# EAGLE design formica_nice (EAGLE 5.06)
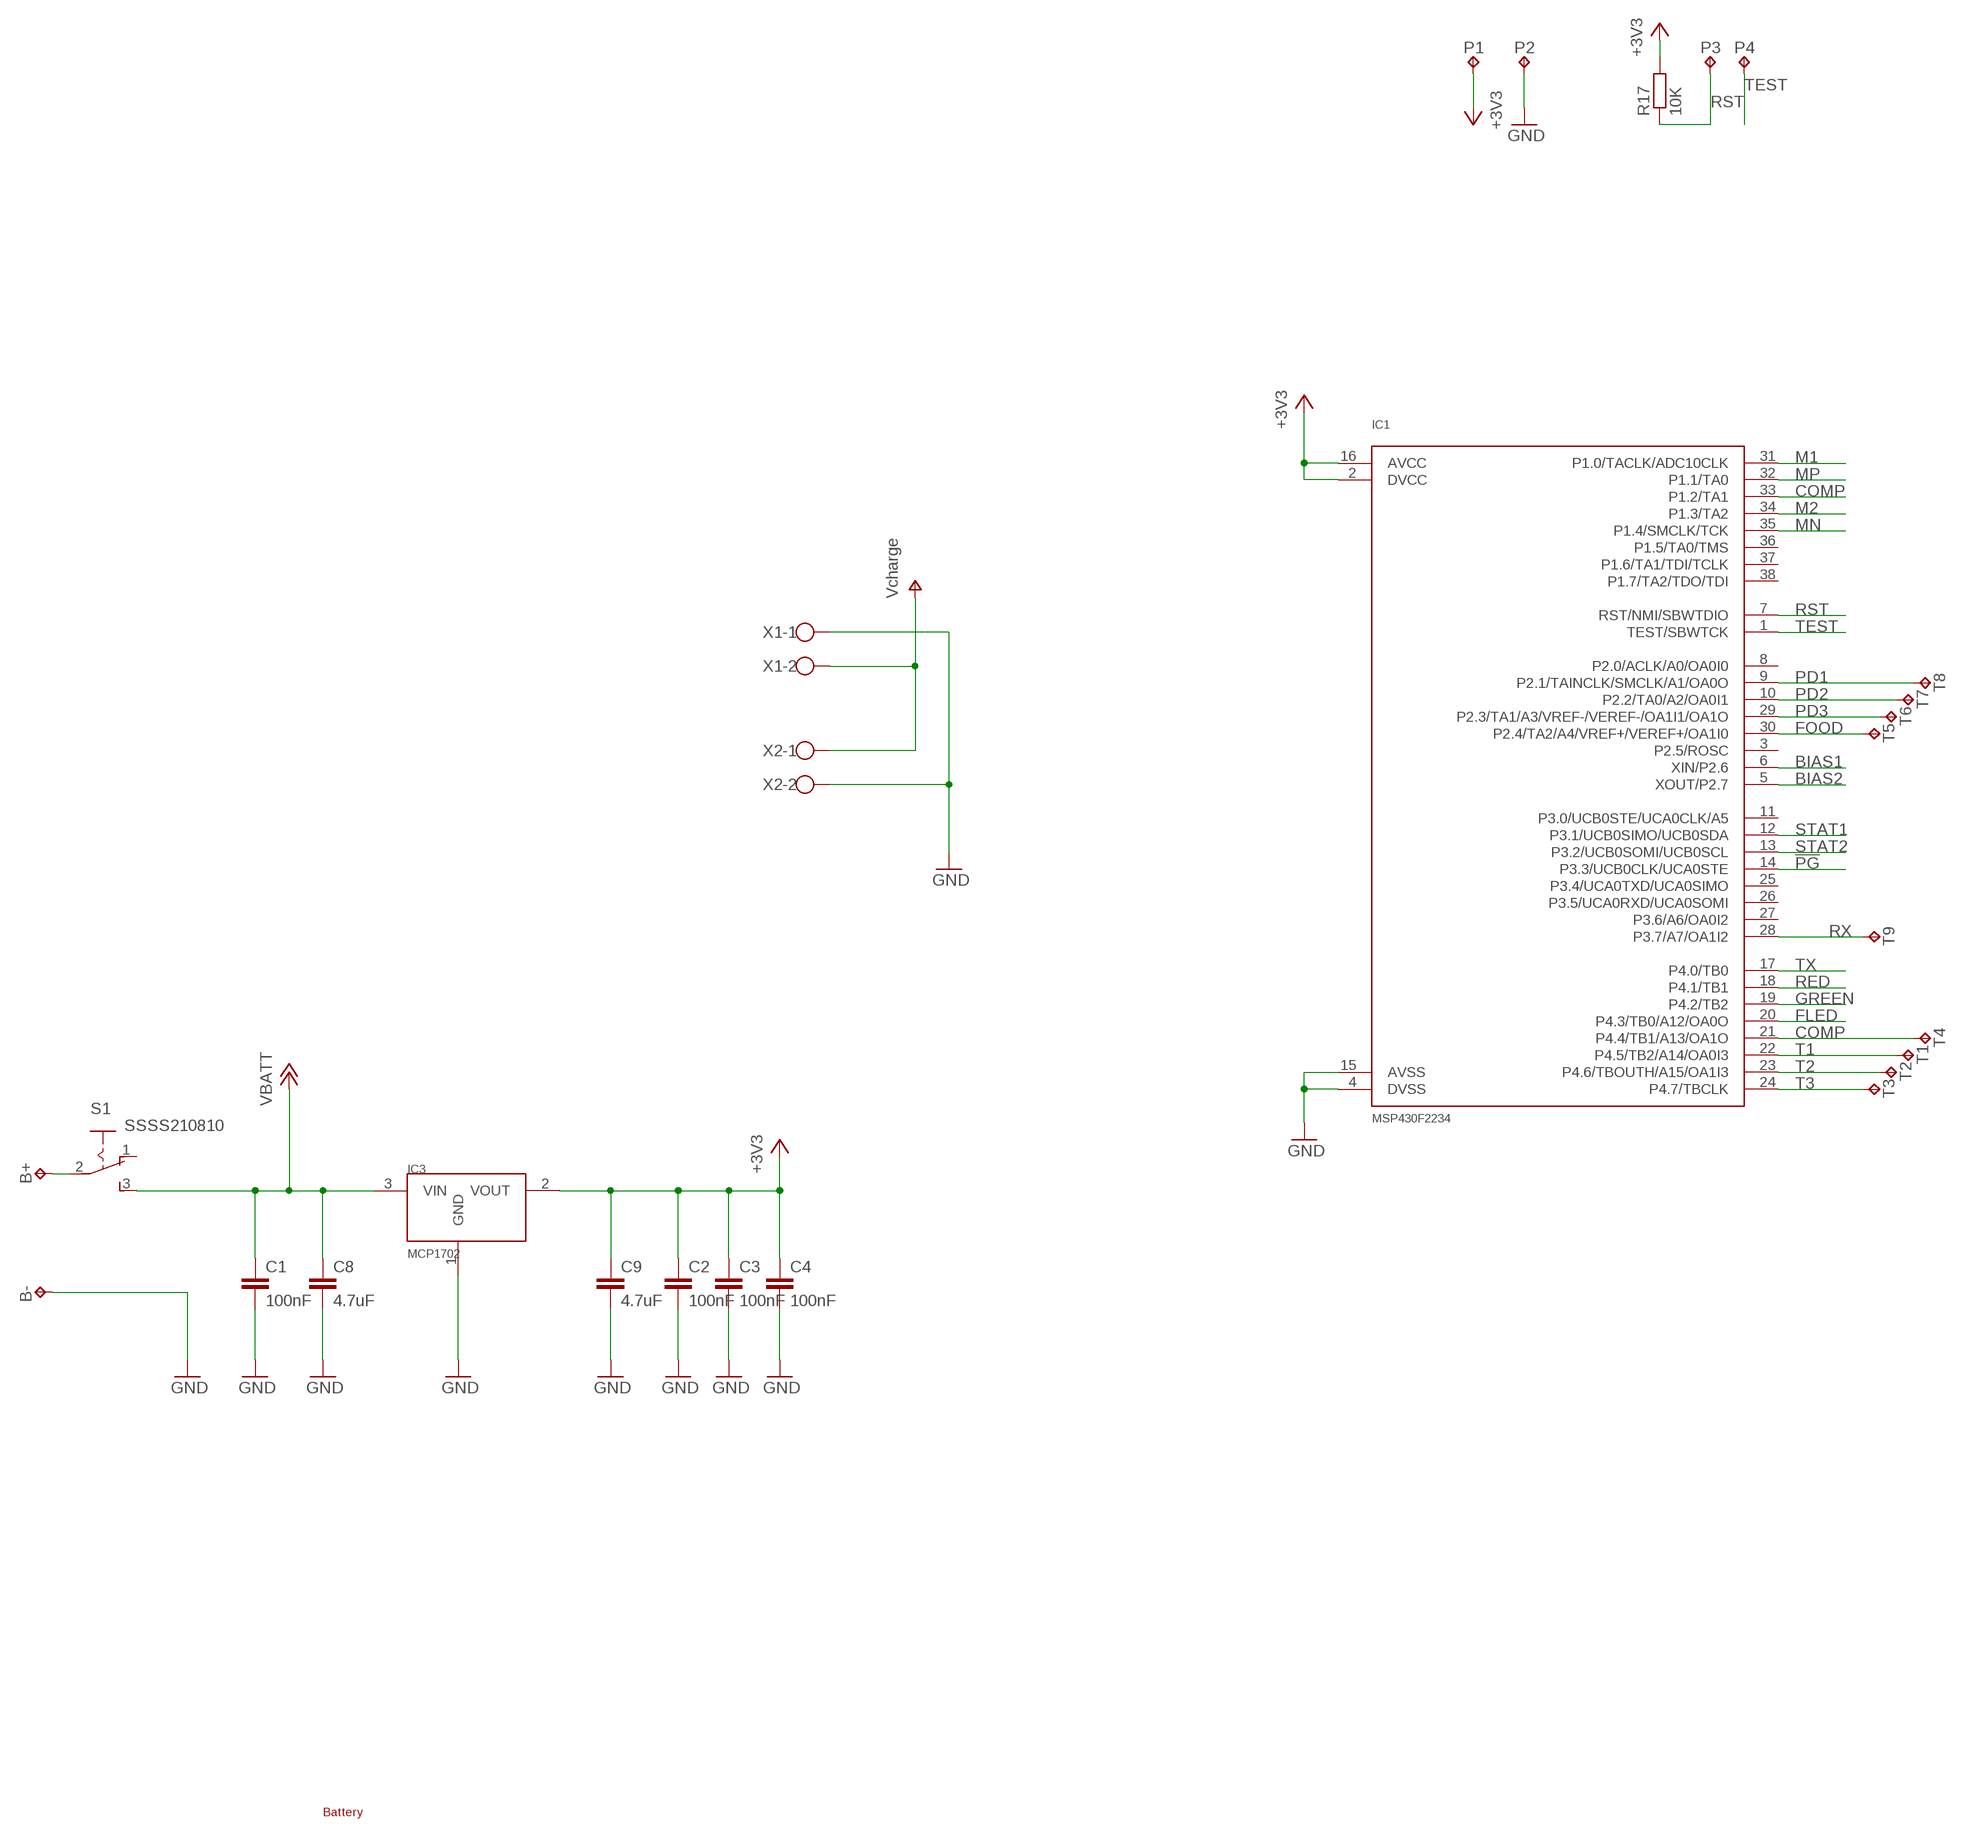
[diagram p0: schematic, sheet 1, part 1 of 2]
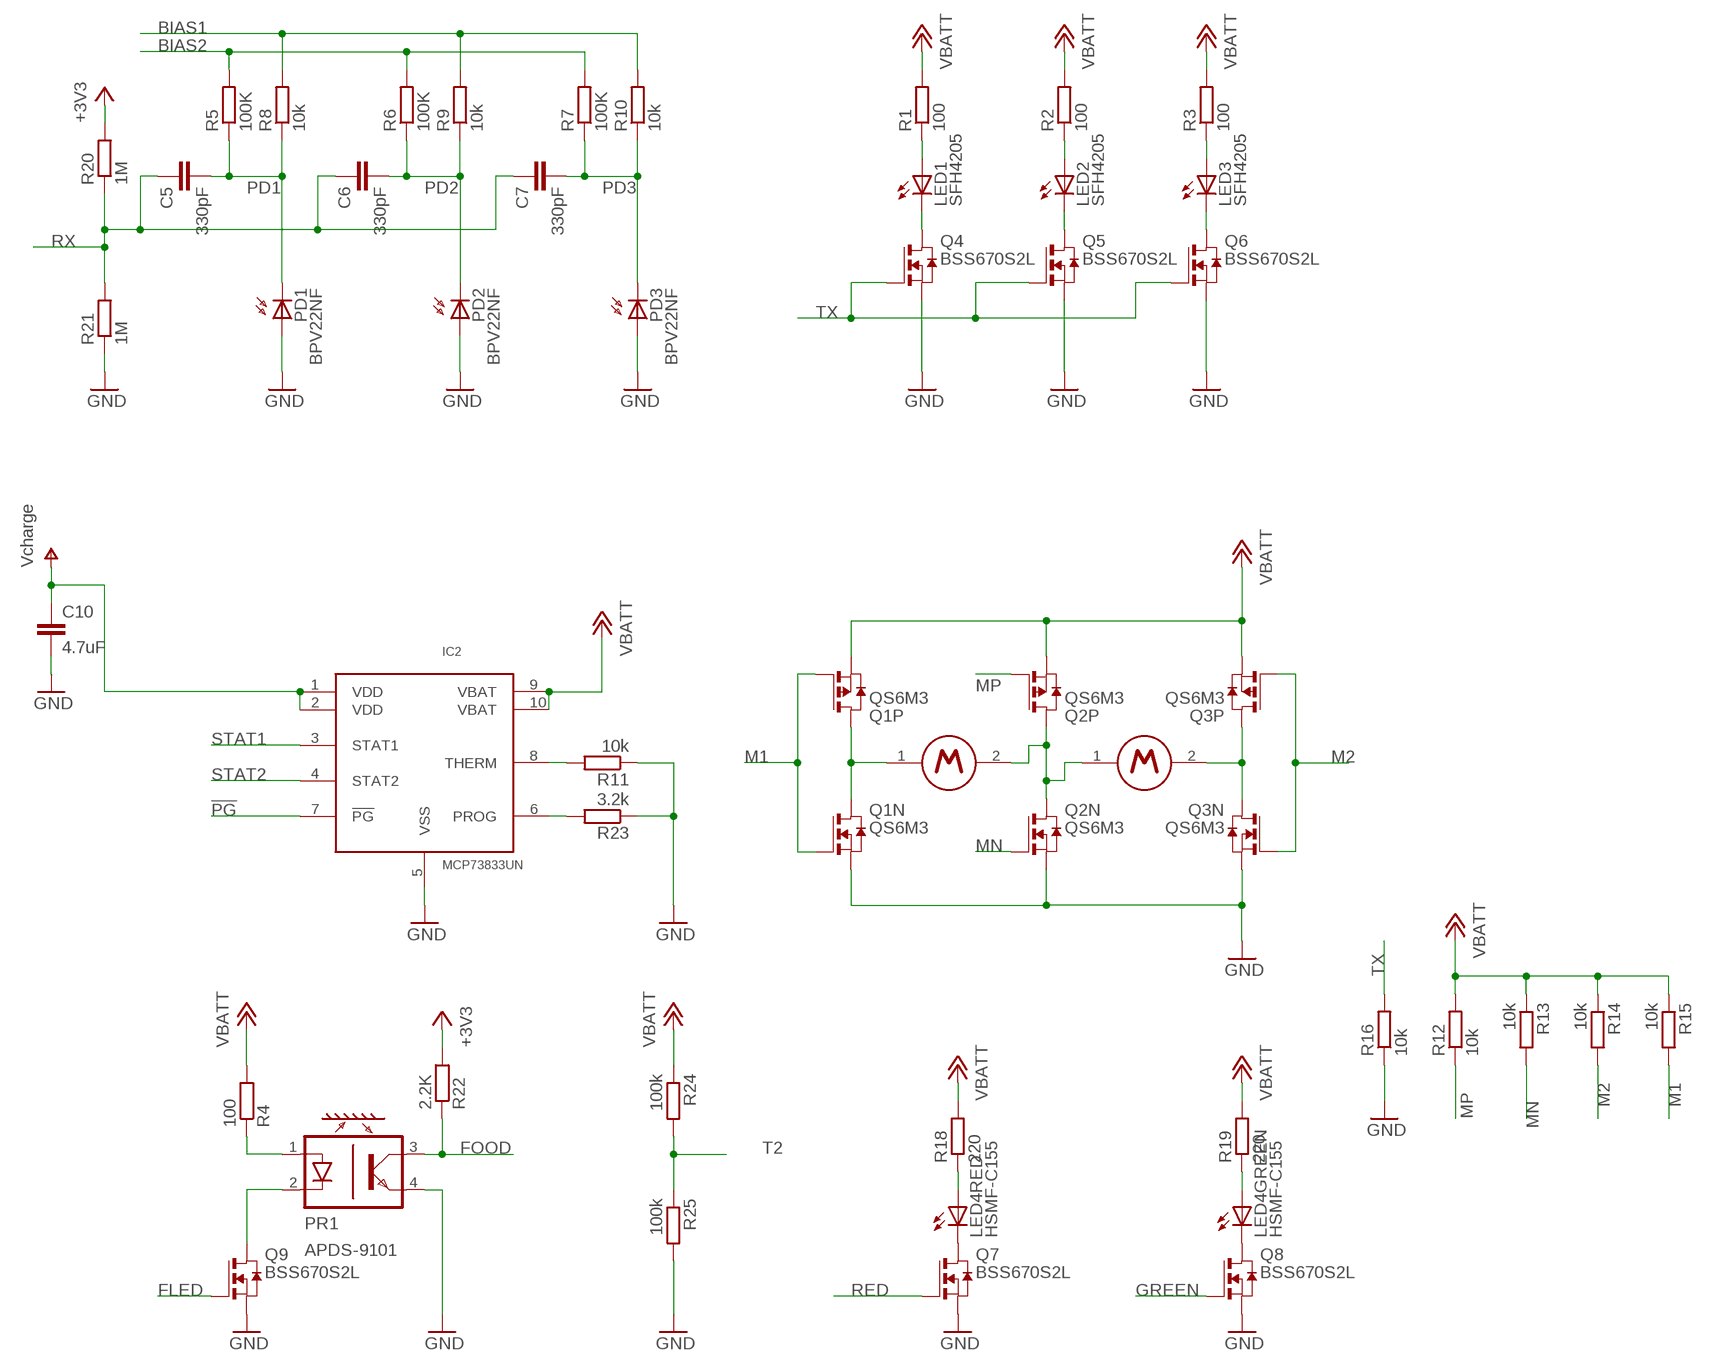
[diagram p1: schematic, sheet 1, part 2 of 2]

## Parts
B+  TPPAD1-13  [P1-13]
B-  TPPAD1-13  [P1-13]
C1  100nF  C-EUC0603  [C0603]
C2  100nF  C-EUC0603  [C0603]
C3  100nF  C-EUC0603  [C0603]
C4  100nF  C-EUC0603  [C0603]
C5  330pF  C-EUC0603  [C0603]
C6  330pF  C-EUC0603  [C0603]
C7  330pF  C-EUC0603  [C0603]
C8  4.7uF  C-EUC0805  [C0805]
C9  4.7uF  C-EUC0805  [C0805]
C10  4.7uF  C-EUC0805  [C0805]
IC1  MSP430F2234  [TSSOP38]
IC2  MCP73833UN  [MSOP10]
IC3  MCP1702  [SOT23-3L]
LED1  SFH4205  [SFH4205]
LED2  SFH4205  [SFH4205]
LED3  SFH4205  [SFH4205]
LED4  HSMF-C155  [BILED]
M1  MOTOR  [MOTOR]
M2  MOTOR  [MOTOR]
P1  TPB1,27  [B1,27]
P2  TPB1,27  [B1,27]
P3  TPB1,27  [B1,27]
P4  TPB1,27  [B1,27]
PD1  BPV22NF  [BPV22NF]
PD2  BPV22NF  [BPV22NF]
PD3  BPV22NF  [BPV22NF]
PR1  APDS-9101  [APDS-9101]
Q1  QS6M3  [SOT23-6]
Q2  QS6M3  [SOT23-6]
Q3  QS6M3  [SOT23-6]
Q4  BSS670S2L  [SOT23-3L]
Q5  BSS670S2L  [SOT23-3L]
Q6  BSS670S2L  [SOT23-3L]
Q7  BSS670S2L  [SOT23-3L]
Q8  BSS670S2L  [SOT23-3L]
Q9  BSS670S2L  [SOT23-3L]
R1  100  R-EU_R0603  [R0603]
R2  100  R-EU_R0603  [R0603]
R3  100  R-EU_R0603  [R0603]
R4  100  R-EU_R0603  [R0603]
R5  100K  R-EU_R0603  [R0603]
R6  100K  R-EU_R0603  [R0603]
R7  100K  R-EU_R0603  [R0603]
R8  10k  R-EU_R0603  [R0603]
R9  10k  R-EU_R0603  [R0603]
R10  10k  R-EU_R0603  [R0603]
R11  10k  R-EU_R0603  [R0603]
R12  10k  R-EU_R0603  [R0603]
R13  10k  R-EU_R0603  [R0603]
R14  10k  R-EU_R0603  [R0603]
R15  10k  R-EU_R0603  [R0603]
R16  10k  R-EU_R0603  [R0603]
R17  10K  R-EU_R0603  [R0603]
R18  220  R-EU_R0603  [R0603]
R19  220  R-EU_R0603  [R0603]
R20  1M  R-EU_R0603  [R0603]
R21  1M  R-EU_R0603  [R0603]
R22  2.2K  R-EU_R0603  [R0603]
R23  3.2k  R-EU_R0603  [R0603]
R24  100k  R-EU_R0603  [R0603]
R25  100k  R-EU_R0603  [R0603]
S1  SSSS210810  [SSSS210810]
T1  TPB1,27  [B1,27]
T2  TPB1,27  [B1,27]
T3  TPB1,27  [B1,27]
T4  TPB1,27  [B1,27]
T5  TPB1,27  [B1,27]
T6  TPB1,27  [B1,27]
T7  TPB1,27  [B1,27]
T8  TPB1,27  [B1,27]
T9  TPB1,27  [B1,27]
U$1  BATTERY  [BATTERY]
X1  W237-102  [W237-102]
X2  W237-102  [W237-102]

## Nets
!PG: IC1.14(P3.3/UCB0CLK/UCA0STE) IC2.7(!PG)
+3V3: C2.1 C3.1 C4.1 C9.1 IC1.2(DVCC) IC1.16(AVCC) IC3.2(VOUT) P1.PP(TP) R17.2 R20.2 R22.2
BATT+: B+.1(TP) S1.2(COM)
BIAS1: IC1.6(XIN/P2.6) R8.2 R9.2 R10.2
BIAS2: IC1.5(XOUT/P2.7) R5.2 R6.2 R7.2
COMP: IC1.21(P4.4/TB1/A13/OA1O) IC1.33(P1.2/TA1) T4.PP(TP)
FLED: IC1.20(P4.3/TB0/A12/OA0O) Q9.1(G)
FOOD: IC1.30(P2.4/TA2/A4/VREF+/VEREF+/OA1I0) PR1.3(COL) R22.1 T5.PP(TP)
GND: B-.1(TP) C1.2 C2.2 C3.2 C4.2 C8.2 C9.2 C10.2 IC1.4(DVSS) IC1.15(AVSS) IC2.5(VSS) IC3.1(GND) P2.PP(TP) PD1.A PD2.A PD3.A PR1.4(EMIT) Q1.5(N:S) Q2.5(N:S) Q3.5(N:S) Q4.2(S) Q5.2(S) Q6.2(S) Q7.2(S) Q8.2(S) Q9.2(S) R11.1 R16.1 R21.1 R23.1 R25.2 X1.1 X2.2
GREEN: IC1.19(P4.2/TB2) Q8.1(G)
M1: IC1.31(P1.0/TACLK/ADC10CLK) Q1.1(N:G) Q1.3(P:G) R15.2
M2: IC1.34(P1.3/TA2) Q3.1(N:G) Q3.3(P:G) R14.2
MN: IC1.35(P1.4/SMCLK/TCK) Q2.1(N:G) R13.2
MP: IC1.32(P1.1/TA0) Q2.3(P:G) R12.1
N$1: LED4.4(RED:K) Q7.3(D)
N$2: LED4.1(GREEN:A) R19.1
N$3: LED4.3(RED:A) R18.1
N$4: M2.2 Q3.4(P:D) Q3.6(N:D)
N$5: M1.2 M2.1 Q2.4(P:D) Q2.6(N:D)
N$6: M1.1 Q1.4(P:D) Q1.6(N:D)
N$7: IC2.8(THERM) R11.2
N$8: IC2.6(PROG) R23.2
N$9: PR1.2(C) Q9.3(D)
N$10: LED1.A R1.1
N$11: LED2.A R2.1
N$12: PR1.1(A) R4.1
N$13: LED3.A R3.1
N$14: LED1.K Q4.3(D)
N$15: LED2.K Q5.3(D)
N$16: LED3.K Q6.3(D)
N$17: LED4.2(GREEN:K) Q8.3(D)
PD1: C5.2 IC1.9(P2.1/TAINCLK/SMCLK/A1/OA0O) PD1.C R5.1 R8.1 T8.PP(TP)
PD2: C6.2 IC1.10(P2.2/TA0/A2/OA0I1) PD2.C R6.1 R9.1 T7.PP(TP)
PD3: C7.2 IC1.29(P2.3/TA1/A3/VREF-/VEREF-/OA1I1/OA1O) PD3.C R7.1 R10.1 T6.PP(TP)
RED: IC1.18(P4.1/TB1) Q7.1(G)
RST: IC1.7(RST/NMI/SBWTDIO) P3.PP(TP) R17.1
RX: C5.1 C6.1 C7.1 IC1.28(P3.7/A7/OA1I2) R20.1 R21.2 T9.PP(TP)
STAT1: IC1.12(P3.1/UCB0SIMO/UCB0SDA) IC2.3(STAT1)
STAT2: IC1.13(P3.2/UCB0SOMI/UCB0SCL) IC2.4(STAT2)
T1: IC1.22(P4.5/TB2/A14/OA0I3) T1.PP(TP)
T2: IC1.23(P4.6/TBOUTH/A15/OA1I3) R24.2 R25.1 T2.PP(TP)
T3: IC1.24(P4.7/TBCLK) T3.PP(TP)
TEST: IC1.1(TEST/SBWTCK) P4.PP(TP)
TX: IC1.17(P4.0/TB0) Q4.1(G) Q5.1(G) Q6.1(G) R16.2
VBATT: C1.1 C8.1 IC2.9(VBAT) IC2.10(VBAT) IC3.3(VIN) Q1.2(P:S) Q2.2(P:S) Q3.2(P:S) R1.2 R2.2 R3.2 R4.2 R12.2 R13.1 R14.1 R15.1 R18.2 R19.2 R24.1 S1.3(NO)
VCHARGE: C10.1 IC2.1(VDD) IC2.2(VDD) X1.2 X2.1 ; supply symbol labelled Vcharge
Unconnected: IC1.3(P2.5/ROSC) IC1.8(P2.0/ACLK/A0/OA0I0) IC1.11(P3.0/UCB0STE/UCA0CLK/A5) IC1.25(P3.4/UCA0TXD/UCA0SIMO) IC1.26(P3.5/UCA0RXD/UCA0SOMI) IC1.27(P3.6/A6/OA0I2) IC1.36(P1.5/TA0/TMS) IC1.37(P1.6/TA1/TDI/TCLK) IC1.38(P1.7/TA2/TDO/TDI) S1.1(NC)

## Library data of the parts
B+ B- P1-P4 T1-T9 = testpad:TP
C1-C10 = rcl:C-EU: CAPACITOR, European symbol
IC1 = formica:MSP430F2234
IC2 = formica:MCP73833
IC3 = formica:MCP1702
LED1-LED3 = formica:SFH4205
LED4 = formica:HSMF-C155
M1 M2 = formica:MOTOR
PD1-PD3 = formica:BPV22NF
PR1 = formica:APDS-9101
Q1-Q3 = formica:QS6M3
Q4-Q9 = formica:BSS670S2L
R1-R25 = rcl:R-EU_: RESISTOR, European symbol
S1 = formica:SSSS210810
U$1 = formica:BATTERY
X1 X2 = con-wago-500:W237-102: WAGO SCREW CLAMP

## Board
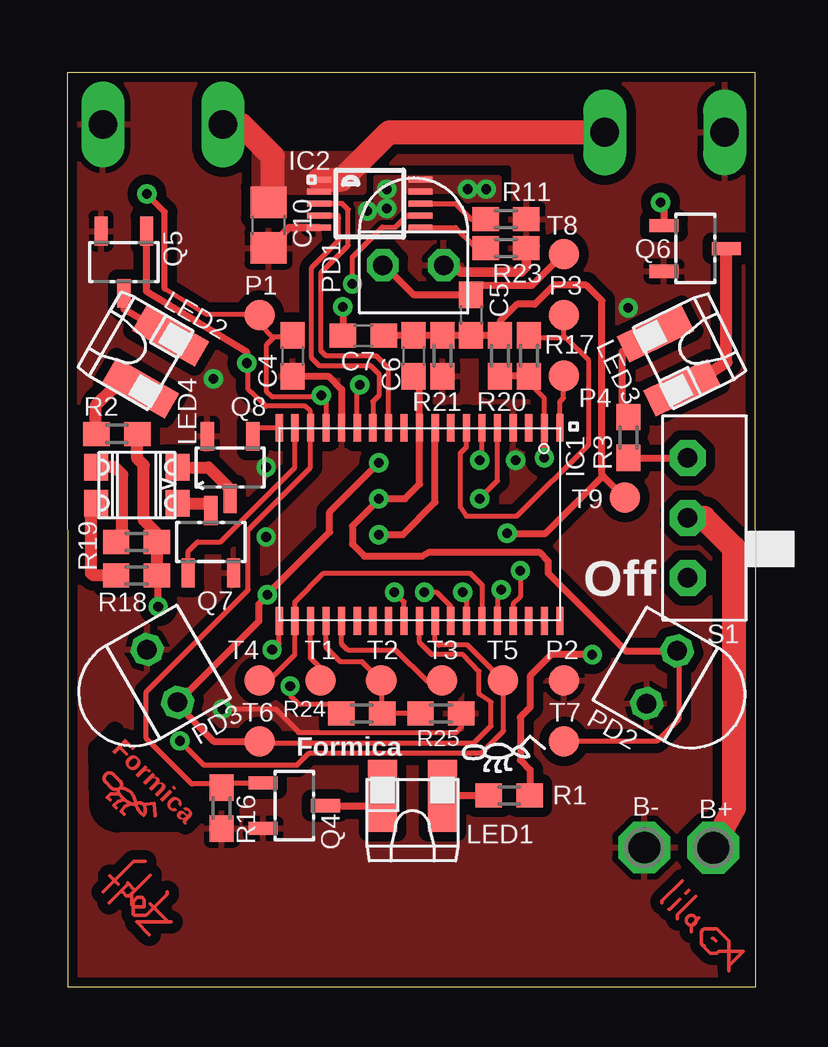
[diagram p2: board, top side]
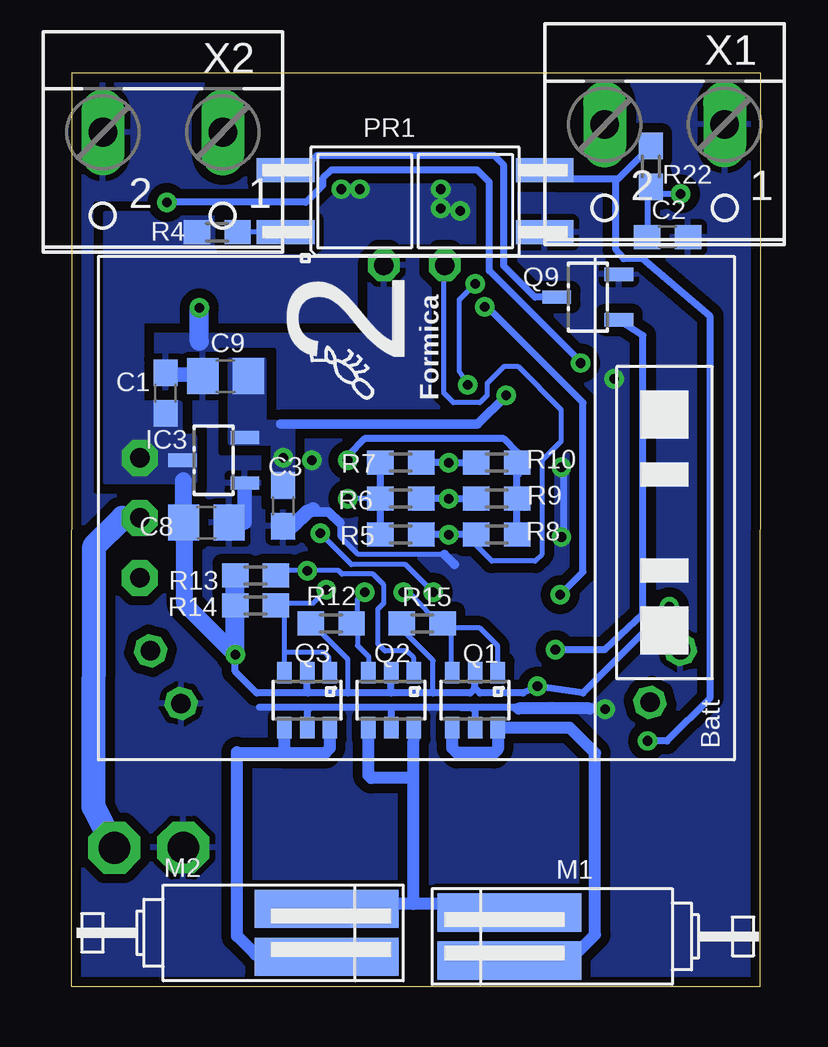
[diagram p3: board, bottom side, seen from below]

Size 28.73 x 38.1 mm. Coordinates in mm from the lower left corner, seen from the top.
Outline: 0.03,0 28.73,0 28.7,38.1 0,38.1 0.03,0
Copper layers (1*16): Top 0.035mm / dielectric 1.5mm / Bottom 0.035mm
Design rules "pcbtrain *": minimum track width 0.2mm, minimum drill 0.4mm, track to track 0.2mm, track to pad 0.2mm, pad to pad 0.2mm, via to via 0.2mm, smd to smd 0.15mm, copper to edge 0.25mm, drill to drill 8mil, minimum pad ring 10mil, minimum via ring 8mil, stop-mask expansion 0.125mm, vias tented up to drill 0mil, thermal gap 10mil
tRestrict: 4 lines
bRestrict: area 14.9,9.2 to 15.9,10.2

### Footprints (pad centres in the part's own frame; a part is rotated, then mirrored left to right if it is on the bottom)
P1-13 = drill 1.321 pad 2.159 octagon: 1 0,0
C0603 = smd 1.1 x 1: 1 -0.85,0; 2 0.85,0
C0805 = smd 1.3 x 1.5: 1 -0.95,0; 2 0.95,0
TSSOP38 = smd 1.15 x 0.3: 1 0,0; 2 0,-0.65; 3 0,-1.3; 4 0,-1.95; 5 0,-2.6; 6 0,-3.25; 7 0,-3.9; 8 0,-4.55; 9 0,-5.2; 10 0,-5.85; 11 0,-6.5; 12 0,-7.15; 13 0,-7.8; 14 0,-8.45; 15 0,-9.1; 16 0,-9.75; 17 0,-10.4; 18 0,-11.05; 19 0,-11.7; 20 8.05,-11.7; 21 8.05,-11.05; 22 8.05,-10.4; 23 8.05,-9.75; 24 8.05,-9.1; 25 8.05,-8.45; 26 8.05,-7.8; 27 8.05,-7.15; 28 8.05,-6.5; 29 8.05,-5.85; 30 8.05,-5.2; 31 8.05,-4.55; 32 8.05,-3.9; 33 8.05,-3.25; 34 8.05,-2.6; 35 8.05,-1.95; 36 8.05,-1.3; 37 8.05,-0.65; 38 8.05,0
MSOP10 = smd 0.25 x 1: 1 -1,-2.113; 2 -0.5,-2.113; 3 0,-2.113; 4 0.5,-2.113; 5 1,-2.113; 6 1,2.113; 7 0.5,2.113; 8 0,2.113; 9 -0.5,2.113; 10 -1,2.113
SOT23-3L = smd 0.55 x 1.2: 1 0.95,1.3; 2 -0.95,1.3; 3 0,-1.3
SFH4205 = smd 1.2 x 3: A -1.25,-0.8; K 1.25,-0.8
BILED = smd 1 x 1.1: 1 -0.1,2.1; 2 3.3,2.1; 3 -0.1,0.6; 4 3.3,0.6
MOTOR = smd 6 x 1.6: 1 6.8,3; 2 6.8,1
B1,27 = smd 1.27 x 1.27: PP 0,0
BPV22NF = drill 0.813 octagon: A 1.37,1.3; C 1.37,-1.24
APDS-9101 = smd 2.4 x 1: 1 -5.4,-1.3; 2 -5.4,1.3; 3 5.4,1.3; 4 5.4,-1.3
SOT23-6 = smd 0.6 x 0.9: 1 -0.95,-1.15; 2 0,-1.15; 3 0.95,-1.15; 4 0.95,1.15; 5 0,1.15; 6 -0.95,1.15
R0603 = smd 1.1 x 1: 1 -0.85,0; 2 0.85,0
SSSS210810 = drill 0.8 pad 1.5 octagon: 1 1.75,2.45; 2 4.25,2.45; 3 6.75,2.45
W237-102 = drill 1.194 long: 1 -2.5,-1.27; 2 2.5,-1.27

### Placement (x,y rotation side)
B+  26.94,5.79 0 top
B-  24.07,5.8 0 top
C1  24.8,24.75 90 bottom
C2  3.88,31.25 0 bottom
C3  19.9,20.05 270 bottom
C4  9.4,26.3 270 top
C5  16.85,28 90 top
C6  14.45,26.3 270 top
C7  12.35,27.15 180 top
C8  23.1,19.35 0 bottom
C9  22.3,25.45 180 bottom
C10  8.4,31.75 270 top
IC1  20.55,23.3 270 top
IC2  12.62,32.65 270 top
IC3  22.8,21.95 270 bottom
LED1  14.4,7.15 180 top
LED2  3,26.45 60 top
LED3  25.8,26.45 296 top
LED4  1.31,19.56 0 top
M1  3.67,4.1 180 bottom
M2  24.9,0.25 0 bottom
P1  8.02,28.01 0 top
P2  20.72,12.77 0 top
P3  20.72,28.01 0 top
P4  20.72,25.47 0 top
PD1  14.4,31.45 270 top
PD2  26,12.25 150 top
PD3  2.8,12.25 30 top
PR1  14.4,32.75 0 bottom
Q1  11.9,11.95 180 bottom
Q2  15.4,11.95 180 bottom
Q3  18.9,11.95 180 bottom
Q4  9.48,7.55 90 top
Q5  2.37,30.21 0 top
Q6  26.19,30.78 90 top
Q7  6,18.55 180 top
Q8  6.8,21.65 0 top
Q9  7.2,28.75 270 bottom
R1  18.44,7.97 0 top
R2  2.08,23.05 0 top
R3  23.4,22.9 270 top
R4  22.65,31.45 180 bottom
R5  15,18.85 180 bottom
R6  15,20.35 180 bottom
R7  15,21.85 180 bottom
R8  11,18.85 0 bottom
R9  11,20.35 0 bottom
R10  11,21.85 0 bottom
R11  18.3,32 180 top
R12  17.9,15.15 180 bottom
R13  21.05,17.15 0 bottom
R14  21.05,15.9 0 bottom
R15  14.1,15.15 0 bottom
R16  6.45,7.45 90 top
R17  19.25,26.3 270 top
R18  2.9,17.15 0 top
R19  2.9,18.55 0 top
R20  18.05,26.3 270 top
R21  15.65,26.3 90 top
R22  4.58,34.2 270 bottom
R23  18.3,30.8 180 top
R24  12.29,11.4 0 top
R25  15.59,11.4 0 top
S1  28.32,15.3 90 top
T1  10.56,12.77 0 top
T2  13.1,12.77 0 top
T3  15.64,12.77 0 top
T4  8.02,12.77 0 top
T5  18.18,12.77 0 top
T6  8.02,10.23 0 top
T7  20.72,10.23 0 top
T8  20.72,30.55 0 top
T9  23.26,20.39 0 top
U$1  27.6,30.45 270 bottom
X1  3.99,34.68 180 bottom
X2  24.91,34.36 180 bottom

### Tracks (layer width: path | path; a pad name or v marks a point on that pad's centre or on a via)
!PG  (via drill 0.4)
  Top 0.2: IC1.14 12.1,24.95 12.2,25.05 v12.2,25.1 | 14.83,32.15 IC2.7 14.18,32.15 13.7,31.68 13.15,31.68 11.9,30.43 v11.9,29.3
  Bottom 0.2: v11.9,29.3 12.55,28.65 12.55,25.65 v12.2,25.1
+3V3  (via drill 0.4)
  Top 0.2: 19.02,25.43 19,25.45 | 19.02,25.43 R17.2 | IC1.2 19.9,24.55 19.02,25.43 | C4.1 9.3,27.15 9.25,27.1 8.65,27.1 8.6,27.05 | 8.6,27.05 8.3,26.75 8.3,24.83 8.55,24.6 10.55,24.6 v10.6,24.65 10.8,24.45 IC1.16 | 8.6,27.05 8.02,27.63 P1.PP 8.02,28.03 8,28.05 5.8,28.05 4.08,29.1
  Top 0.25: 4.08,29.1 4.08,32.3 v3.32,33.05
  Top 0.3: v19.9,22.05 IC1.2 | R17.2 R20.2
  Bottom 0.25: 4.72,33.2 C2.1 | 4.72,33.2 R22.2 | 4.72,33.2 4.58,33.05 v3.32,33.05
  Bottom 0.3: v19.9,22.05 20.1,21.95 | C2.1 4.85,31.23
  Bottom 0.4: v10.6,24.65 11.8,23.45 20,23.45
  pour Bottom (isolate 0.01, no thermals): 19.5,23.55 19.5,20.4 20.3,20.4 20.3,22.65 22.1,22.65 22.1,26.15 20.7,26.15 20.7,23.55
ANT
  Top 0.15: 1.65,8.5 1.82,8.32 arc90 2.21,8.29 | 2.21,8.29 arc-90 2.85,7.65 2.86,7.63 2.92,7.65 arc-62 3.17,7.61 | 2.21,8.29 arc90 2.21,8.57 1.99,8.79 | 1.99,8.79 1.97,8.82 | 1.61,8.53 arc-180 1.93,8.85 1.99,8.79 | 2.05,7.46 1.95,7.56 2.12,7.74 2.35,7.79 2.39,7.8 2.59,7.67 2.68,7.63 | 2.39,7.19 2.27,7.31 2.41,7.52 2.68,7.63 | 2.84,7.58 arc-52 2.11,8.18 2.16,8.07 2.11,8.04 1.82,8.04 1.68,7.9 1.79,7.79 | 3.17,7.61 arc-76 3.2,7.15 arc-37 2.88,7.55 2.84,7.58 | 3.66,7.12 3.63,7.65 3.24,7.61 3.17,7.61 | 2.68,7.63 2.67,7.63 2.86,7.57 2.84,7.58
BATT+
  Top 1: 26.95,5.88 27.8,7.45 27.8,18.3 26.55,19.55 S1.2
  Bottom 1: B+.1 27.8,7.48 27.78,18.38 26.6,19.55 S1.2
BIAS1  (via drill 0.4)
  Top 0.2: IC1.6 17.3,22.05 v17.2,21.95
  Bottom 0.3: R8.2 10.2,18.85 10.15,18.9 R9.2 10.15,21.7 | 10.15,21.7 R10.2 | 10.15,21.7 10.1,21.35 | 10.15,21.7 10.15,22.3 10.71,22.85 16.5,22.85 17.2,22.15 v17.2,21.95
BIAS2  (via drill 0.4)
  Top 0.2: IC1.5 17.95,21.1 v17.2,20.35
  Top 0.3: v17.2,20.35
  Bottom 0.2: 15.9,20.35 v17.2,20.35
  Bottom 0.3: R7.2 15.85,20.4 15.9,20.35 R6.2 15.85,18.8 | R5.2 15.85,18.8 | 15.85,18.8 15.9,18.75
COMP
  Top 0.2: IC1.33 17.3,16.75 16.8,17.25 10.7,17.25 9.5,16.05 IC1.21 9.5,13.85 8.42,12.77 T4.PP 8.08,12.77 8.1,12.75
FLED  (via drill 0.4)
  Top 0.2: v8.55,14.05 8.6,14.05 8.85,14.3 IC1.20
  Bottom 0.3: Q9.1 4.9,27.15 4.9,15.55 6.5,14.05 v8.55,14.05
FOOD  (via drill 0.4)
  Top 0.2: 18.1,12.75 18.12,12.77 T5.PP | IC1.30 15.35,14.4 15.5,14.25 16.7,14.25 T5.PP | T5.PP 18.2,12.75 | v4.7,10.25 5.7,9.25 9.6,9.25 10.1,9.75 17.28,9.75 18.2,10.67 18.2,12.85 18.18,12.83 T5.PP
  Bottom 0.25: 8.43,33.68 5.95,33.68
  Bottom 0.3: 8.85,34 8.9,34.05 PR1.3 8.8,34.05 8.43,33.68 6.02,33.68 6.02,30.73 5.7,30.35 4.9,30.35 2.1,27.95 2.1,12.05 3.9,10.25 v4.7,10.25 | 5.95,33.68 R22.1
GND  (via drill 0.4)
  Top 0.2: 9.68,10.6 9.65,10.6 | 9.68,10.6 16.21,10.6 16.44,10.82 R25.2 | 9.68,10.6 8.7,11.57 v6.47,11.57
  Top 0.3: 9.45,25.7 9.7,25.45 10.9,25.45 11.45,24.9 IC1.15
  Top 0.305: IC2.5 9.25,31.65 C10.2
  Top 0.4: C4.2 9.45,25.7 | PD1.A 16.12,30.08 16.4,29.8 18.95,29.8 19.15,30 R23.1
  Bottom 0.2: 18.75,11.65 18.8,11.65 | 17.53,19.33 17.53,18.78 16.78,18.03 13.18,18.03 | 15.12,11.65 16.45,11.65 | v6.47,11.57 6.35,11.45 6.35,11.28
  Bottom 0.3: Q1.5 11.9,11.5 12.05,11.65 12.5,11.65 | 12.5,11.65 15.12,11.65 15.4,11.65 | 15.4,11.65 16.45,11.65 18.75,11.65 18.9,11.5 Q3.5 | 15.4,11.65 Q2.5 | 18.8,11.65 20.9,11.65 | 8.2,18.65 8.2,21.75 | 12.5,11.65 10.12,11.65 10.08,11.6 | C8.2 22.2,19.35 | 24.73,25.53 23.35,25.53
  Bottom 0.4: C8.2 22.15,19.4 | 12.75,17.6 13.18,18.03 | 19.5,19.2 C3.2 | 17.53,19.33 18,19.8 18.9,19.8 18.85,19.8
  Bottom 0.5: 7.12,11.6 10.08,11.6
  Bottom 0.6: IC3.1 21.5,19.35 22.2,19.35 | 18.65,19.9 18.9,19.8 19.5,19.2 | 23.35,25.53 24.88,25.53 | C1.2 24.73,25.53
  Bottom 0.8: 23.4,26.9 v23.4,28.3
  other vias: 8.3,21.65 8.3,18.75 18.7,21.95 6.1,25.35
  pour Bottom (isolate 0.4, rank 2): -0.45,38.3 -0.23,-0.3 28.87,-0.53 29.12,-0.27 28.85,38.3
  pour Top (isolate 0.4, rank 2): -0.6,35.85 -0.5,-0.75 29.05,-0.8 28.95,38.45 -0.55,38.45
GREEN
  Top 0.2: Q8.1 7.75,23.2 7.7,23.25 7.75,23.3 IC1.19
M1  (via drill 0.4)
  Top 0.2: IC1.31 16,15.85 15.4,16.45 v14.9,16.45
  Bottom 0.2: 12.9,13.25 12.9,14.9 13,15 R15.2 13.25,15 | Q1.1 10.95,14.2 11.7,14.95 13.25,14.95 13.25,15 | v14.9,16.45 14.65,16.45 13.25,15
  Bottom 0.3: v14.9,16.45 14.9,16.35 | Q1.3 12.85,13.2 12.9,13.25
M2  (via drill 0.4)
  Top 0.2: IC1.34 17.95,16.5 v18.1,16.55
  Bottom 0.2: 17.95,16.4 v18.1,16.55 18.65,16 20.05,16 R14.2 20,15.85 19.85,15.8 19.85,13.95 | Q3.1 18,13.15 18,13.75 18.2,13.95 19.85,13.95 | Q3.3 19.85,13.95
MN  (via drill 0.4)
  Top 0.2: v18.9,17.35 18.9,16.25 18.6,15.95 IC1.35
  Bottom 0.2: 14.4,13.05 Q2.1 14.45,13.7 14.75,14 15.65,14 15.95,14.3 15.95,15.75 15.7,16 15.7,16.75 16.15,17.2 17.45,17.2 17.6,17.35 v18.9,17.35 20,17.35 R13.2
MP  (via drill 0.4)
  Top 0.2: v16.5,16.45 16.5,16.55 | IC1.32 16.65,16.4 v16.5,16.45 | v16.5,16.45 16.6,16.55
  Bottom 0.2: R12.1 16.8,14.95 | Q2.3 16.35,13.78 16.8,14.22 16.8,14.95 | 16.8,14.95 16.8,16.15 v16.5,16.45
N$1
  Top 0.5: Q7.3 6,20.15 4.6,20.15 LED4.4
N$2
  Top 0.5: LED4.1 1.99,21.66 2.3,21.35 2.3,18.75 2.1,18.55 R19.1
N$3
  Top 0.5: R18.1 1.1,17.15 1,17.25 1,20.05 1.2,20.25 1.21,20.24 LED4.3
N$4
  Bottom 0.5: Q3.6 17.95,9.95 18.15,9.75 19.85,9.75 | 19.85,9.75 Q3.4 | 19.85,9.75 21.82,9.78 21.82,2.12 21.05,1.35 18.5,1.35 M2.2
N$5
  Bottom 0.5: M1.2 11.3,3.45 14.48,3.45 | 14.48,3.45 16.28,3.45 16.82,2.9 M2.1 | 14.48,3.45 14.48,8.7 | 14.48,8.7 14.48,9.72 Q2.6 | Q2.4 16.35,8.82 16.23,8.7 14.48,8.7
N$6
  Bottom 0.406: 7.97,1.1 M1.1
  Bottom 0.5: Q1.4 12.85,9.95 12.65,9.75 11.1,9.75 10.95,9.9 Q1.6 7.95,10.8 6.9,9.75 6.9,2.18 7.97,1.1 | M1.1 10.55,1.1
N$7
  Top 0.2: IC2.8 16.2,32.65 16.85,32 R11.2
N$8
  Top 0.2: IC2.6 16.2,31.65 17,30.85 17.53,30.85 | 17.53,30.85 17.4,31.05 | 17.53,30.85 R23.2
N$9
  Bottom 0.3: PR1.2 18.9,34.25 18.5,34.65 11.1,34.65 10.7,34.25 10.7,30.05 9.4,28.75 Q9.3 8.4,28.75
N$10
  Top 0.3: R1.1 17.6,7.96 17.6,7.95 LED1.A
N$11
  Top 0.5: LED2.A 1.92,24.97 1.2,24.25 1.2,23.05 R2.1
N$12
  Bottom 0.2: PR1.1 R4.1
N$13
  Top 0.3: LED3.A 23.15,26.5 23.15,24.1 23.4,23.85 R3.1
N$14
  Top 0.3: LED1.K 13.1,7.9 13.1,7.55 Q4.3
N$15
  Top 0.3: Q5.3 2.38,28.25 LED2.K
N$16
  Top 0.5: LED3.K 25.78,24.97 25.8,24.95 27.49,26.04 Q6.3
N$17
  Top 0.5: Q8.3 6.8,20.75 5.9,21.65 4.8,21.65 4.79,21.66 LED4.2
N$18
  Top 0.15: 25.65,4.42 24.8,3.58 24.8,3.5
N$19
  Top 0.15: 25.55,3.65 25.12,3.23 25.1,3.23
N$20
  Top 0.15: 25.8,3.9 25.93,4.02
N$21
  Top 0.15: 26.23,3.77 25.45,3 25.45,2.83
N$22
  Top 0.15: 26.35,2.88 26.03,2.55 26.03,2.3
N$23
  Top 0.15: 26.57,1.7 arc-90 26.45,1.83 26.45,2.25 arc-90 26.62,2.43 27.1,2.43 27.6,1.93 27.6,0.88 | 27.6,0.88 27.6,0.67 | 27.6,0.88 28.2,1.48 27.18,1.48 27.1,1.4 26.82,1.4 26.6,1.62
N$24
  Top 0.15: 26.9,2.02 26.95,2.02 27.05,1.93
N$25
  Top 0.15: 1.5,3.95 2.77,5.22 3.25,5.22
N$26
  Top 0.15: 2.12,4.27 1.78,4.62
N$27
  Top 0.15: 1.75,3.5 2.52,4.27 2.52,4.32 2.8,4.05 2.8,4 2.6,3.8 2.47,3.8 2.32,3.95 2.22,3.95
N$28
  Top 0.15: 3.47,4.65 2.7,3.88 2.7,3.43 2.8,3.33 3.22,3.33 3.22,3.62 3.12,3.73 2.92,3.73 2.75,3.55 2.75,3.02 2.8,2.98 3.25,2.98
N$29
  Top 0.15: 3.32,3 4.17,3.85 4.17,3.95
N$30
  Top 0.15: 4.22,2.7 3.47,3.45 | 4.22,2.7 4.35,2.7 | 4.22,2.7 2.9,2.7 3.42,2.18
PD1  (via drill 0.4)
  Top 0.3: IC1.9 15.35,20.2 14,18.85 v13,18.85 | PD1.C 13.18,30.08 13.2,30.1 14.45,28.85 C5.2 17.25,29.25 19.4,29.25 20.7,30.55 T8.PP
  Bottom 0.2: 13.2,29.75 13.2,24.75 12.8,24.35 11.7,24.35 11.4,24.65 11.4,25.15 10.7,25.85 10.1,25.85 8.3,24.05 8.3,22.75 9.1,21.95 9.1,18.05 9.4,17.75 11.2,17.75 11.85,18.4 R8.1
  Bottom 0.3: R5.1 14.2,18.85 | R5.1 v13,18.85 R8.1 11.8,18.85 | R5.1 14.15,18.9 | 13.15,29.75 13.16,29.76 PD1.C 13.17,29.78 13.2,29.75
PD2  (via drill 0.4)
  Top 0.2: T7.PP 24.58,10.23 25.5,11.15 25.5,14.05 25.46,14.01 PD2.C
  Top 0.3: 13.05,20.35 14.1,20.35 14.7,20.95 IC1.10 14.7,25.15 arc45 14.67,25.24 C6.2 | PD2.C 23.3,14 20.05,17.25 20.05,17.75 19.69,18.12 15.1,18.12 14.8,17.95 12.4,17.95 11.9,18.45 11.9,19.2 13.05,20.35 | 13.05,20.35 v13,20.35
  Bottom 0.3: 14.2,20.35 R6.1 v13,20.35 R9.1
PD3  (via drill 0.4)
  Top 0.2: IC1.29 14.7,14.35 15.2,13.85 16.5,13.85 17.18,13.15 17.18,12.2 17.68,11.88 17.68,10.88 16.98,10.17 8.55,10.17 8.55,10.23 T6.PP 8,10.25
  Top 0.3: v13,21.85 10.95,19.8 10.95,18.95 v8.35,16.35 8.4,16.35 8,15.95 8,15.25 PD3.C | v11.5,28.35 C7.2 | T6.PP 6.12,10.23 4.5,11.85 4.51,11.86 PD3.C | PD3.C 4.6,11.85
  Bottom 0.3: 14.15,21.8 14.2,21.75 | 14.15,21.8 R7.1 v13,21.85 R10.1 | 14.15,21.8 14.1,21.85 | v11.5,28.35 11.45,28.3 11.45,28.4 7.4,24.35 7.4,17.3 v8.35,16.35
RED
  Top 0.2: IC1.18 9.5,21.65 6.4,18.55 5.45,18.55 5.05,18.15 Q7.1
RST
  Top 0.2: IC1.7 16.65,22.5 16.4,22.25 16.4,20 16.65,19.62 18.75,19.62 21.75,22.6 21.75,26.1 20.8,27.05 20.7,27.05 | R17.1 19.03,27.08 19,27.05 20.7,27.05 | P3.PP 20.72,27.07 20.7,27.05
RX  (via drill 0.4)
  Top 0.2: IC1.28 14.05,16.05 v13.65,16.45
  Top 0.3: C7.1 C6.1 R21.2 C5.1 R20.1 18.05,27.75 18.75,28.45 19.5,28.45 20.3,29.25 21.65,29.25 22.3,28.6 22.3,21.35 22.35,21.3 | 22.35,21.3 T9.PP | v18.35,18.9 19.95,18.9 22.35,21.3
  Bottom 0.2: v13.65,16.45 14.8,17.6 17.05,17.6 v18.35,18.9
STAT1
  Top 0.2: 11.25,32.65 IC2.3 11.48,32.65 11.73,32.4 11.73,30.9 10.6,29.78 10.6,26.5 10.8,26.3 12.9,26.3 13.4,25.8 IC1.12
STAT2
  Top 0.2: 11.3,32.15 IC2.4 11.23,32.15 11.33,32.05 11.33,31.1 10.2,29.98 10.2,26.2 10.5,25.9 12.65,25.9 13,25.55 13,24.65 12.75,24.4 IC1.13
T1
  Top 0.2: IC1.22 10.15,13.7 10.5,13.35 10.5,12.75 10.52,12.77 T1.PP
T2
  Top 0.2: IC1.23 10.8,14.15 11.4,13.55 12.3,13.55 13.1,12.75 T2.PP 13.14,12.73 R24.2 | R24.2 13.1,11.39 | R25.1 R24.2
T3
  Top 0.2: IC1.24 11.45,14.3 11.7,14.05 13.7,14.05 15,12.75 15.62,12.77 T3.PP
TEST
  Top 0.2: IC1.1 20.55,24.4 20.7,24.55 20.7,25.45 P4.PP
TX  (via drill 0.4)
  Top 0.2: 7.55,26 7.55,24.9 8.3,24.2 9.93,24.2 10.15,24 IC1.17 10.15,21.65 7.55,19.05 7.55,16.55 3.3,12.3 3.3,10.35 5.2,8.45 6.4,8.45 R16.2 | R16.2 6.4,8.25 | Q4.1 6.65,8.5 R16.2
  Top 0.3: Q6.1 24.89,32.56 v24.75,32.7 | 7.55,26 v7.5,26 7.5,26.45 3.32,28.98 Q5.1
  Bottom 0.2: 7.6,25.95 v7.5,26 7.6,26.15
  Bottom 0.3: v24.75,32.7 18.95,32.7 18.25,33.4 18.25,33.7 17.9,34.05 11.8,34.05 11.3,33.55 11.3,29.85 7.6,26.15
VBATT  (via drill 0.4)
  Top 0.2: v9.3,12.53 9.3,12.15 9.65,11.8 11.04,11.8 R24.1 11.17,11.62
  Top 0.3: R1.2 19.3,8.16 19.3,9.05 18.9,9.45 18.9,11.25 19.3,11.65 19.3,12.95 20.2,13.85 v21.9,13.85 | v3.8,15.85 3.8,17.15 | S1.3 25.9,22.25 25.7,22.05 R3.2
  Top 0.5: R18.2 3.8,17.15 3.75,17.2 R19.2 3.75,18.8 3.8,18.85 3.2,19.45 3.2,21.75 2.93,22.02 R2.2
  Bottom 0.2: R12.2 18.75,15.2 17.2,13.65 17.2,12.25 | 13.65,12.2 13.65,12.25 13.65,13.6 15.05,15 R15.1
  Bottom 0.3: Q3.2 18.9,12.4 18.85,12.25 | 15.4,12.25 13.65,12.25 12.1,12.25 11.9,12.45 | 15.4,12.25 17.2,12.25 18.85,12.25 | 15.4,12.25 Q2.2 | 18.85,12.25 21,12.25 21.9,13.15 v21.9,13.85 | 11.9,12.45 Q1.2 | 11.9,12.45 11.7,12.25 9.9,12.25 v9.3,12.53 7.4,12.25 v3.8,15.85
  Bottom 0.7: 24.05,21.1 C8.1 24,19.65 24,15.95 v21.9,13.85
  Bottom 0.8: R14.1 21.9,15.95 | v21.9,13.85 R14.1 | R14.1 R13.1
  other vias: 17.48,33.25 16.7,33.25 13.33,33.25 13.33,32.45 12.53,32.35
  pour Top (no thermals): 12.88,33.75 18,33.75 18,32.75 16.7,32.75 16.3,33.15 14.12,33.15 13.93,32.95 14.7,31.45 11.93,31.45 11.93,32.65 12.88,32.65
  pour Bottom (isolate 0.4, no thermals): 17.88,33.95 11.3,33.95 11.3,31.05 16.1,31.05 16.9,30.25 16.9,27.75 25.8,27.75 25.8,24.35 24.2,24.35 24.2,22.95 23.6,22.95 23.6,21.05 27.3,21.05 27.3,32.25 19.57,32.25
VCHARGE
  Top 1: 8.29,32.95 8.39,33.06 8.4,33.05 C10.1 8.58,32.88 8.58,34.62 7.27,35.93 X1.2 | X2.1 13.43,35.62 11.45,33.65 IC2.1
  pour Top (no thermals): 7.8,34.73 7.8,33.15 12.38,33.15 12.4,34.7
(copper drawn outside any net)
  shapes: Top circle x1

### Text on the board
Top: Formica
tNames: Off | Formica
bNames: 2 | Formica | Batt